# Altium project aboutlove.PrjPCB
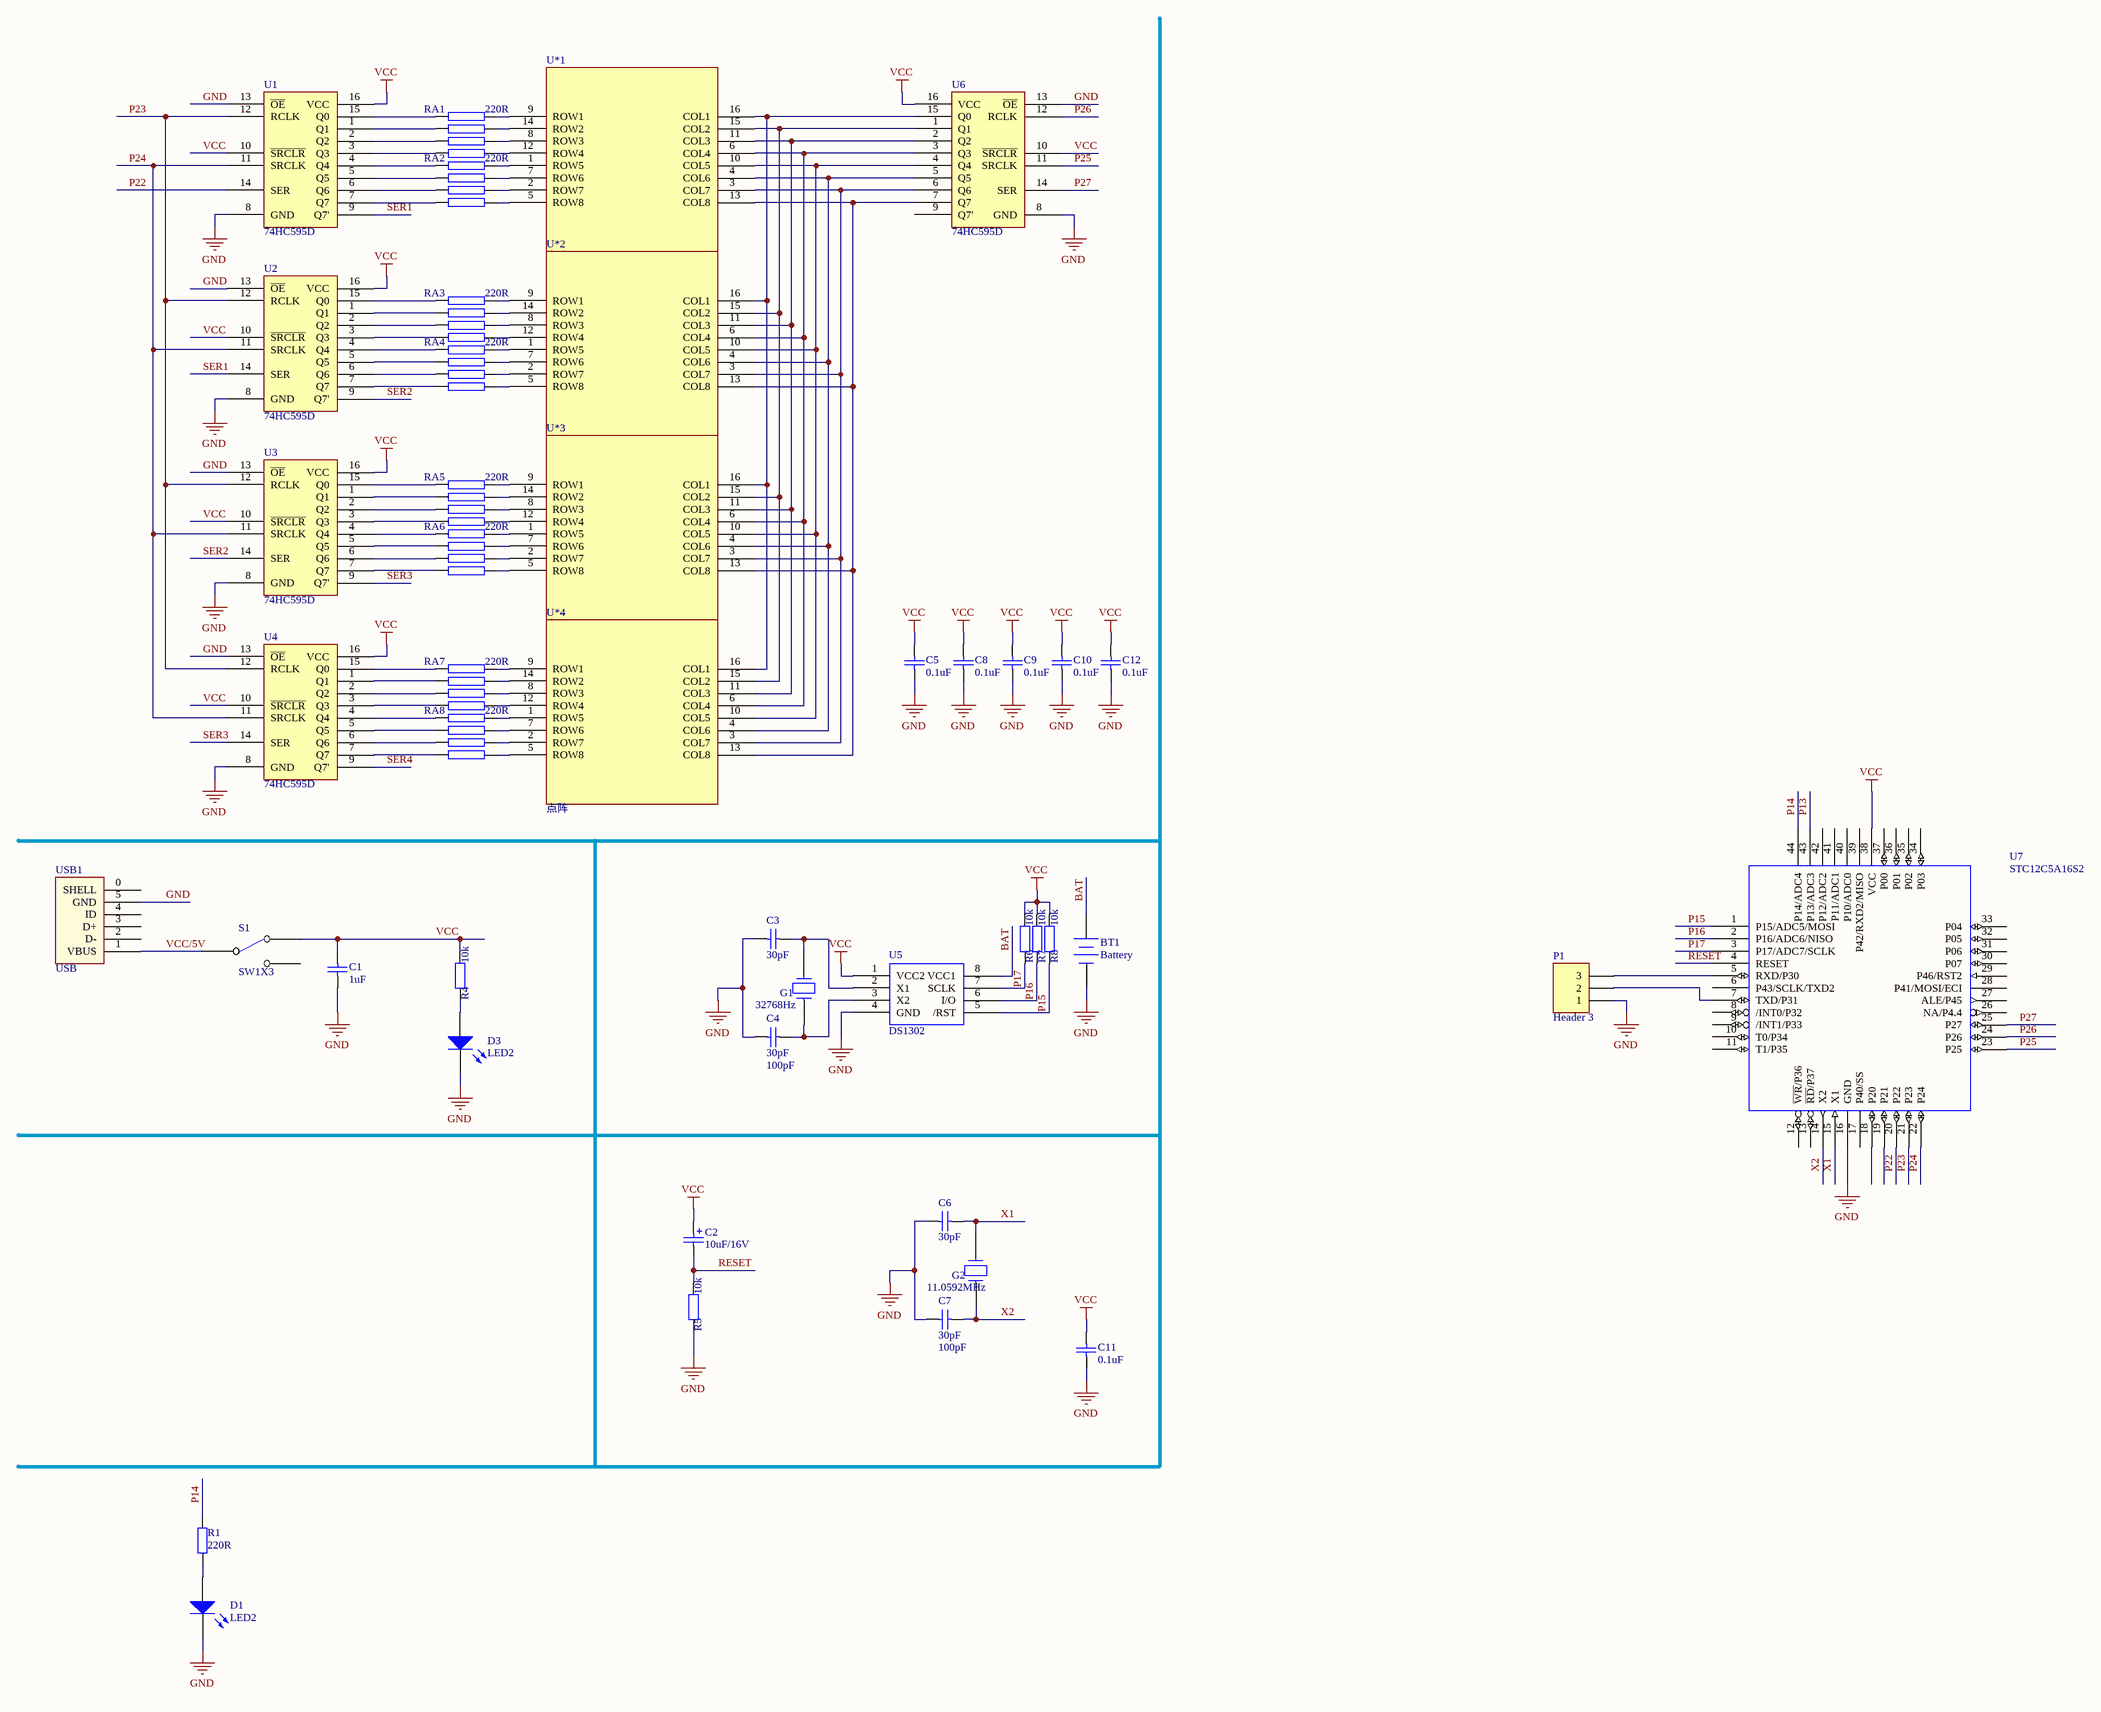
[diagram p0: aboutlove.SchDoc]
1 sheet, 45 parts. Net scope: global (net labels, ports and power ports of the same name join across sheets).
Board file: aboutlove.PcbDoc

## Sheet aboutlove.SchDoc
size A2

### Parts
BT1  Battery  [BAT-CR1220]
C1  1uF  [0805]
C2  10uF/16V  [RB.1/.2A]
C3  30pF  [0603_SMALL]
C4  30pF  value 100pF  [0603_SMALL]
C5  0.1uF  [0603_SMALL]
C6  30pF  [0603_SMALL]
C7  30pF  value 100pF  [0603_SMALL]
C8  0.1uF  [0603_SMALL]
C9  0.1uF  [0603_SMALL]
C10  0.1uF  [0603_SMALL]
C11  0.1uF  [0603_SMALL]
C12  0.1uF  [0603_SMALL]
D1  LED2  [LED0805]
D3  LED2  [LED0805]
G1  32768Hz  [SIP2]
G2  11.0592MHz  [XTAL1_ARC]
P1  Header 3  [HDR1X3]
R1  220R  [0603_SMALL]
R4  10k  [0805]
R5  10k  [0603_SMALL]
R6  10k  [0603_SMALL]
R7  10k  [0603_SMALL]
R8  10k  [0603_SMALL]
RA1  220R  [NR4_L]
RA2  220R  [NR4_L]
RA3  220R  [NR4_L]
RA4  220R  [NR4_L]
RA5  220R  [NR4_L]
RA6  220R  [NR4_L]
RA7  220R  [NR4_L]
RA8  220R  [NR4_L]
S1  SW1X3  [SW1X3]
U1  74HC595D  [SOP16]
U2  74HC595D  [SOP16]
U3  74HC595D  [SOP16]
U4  74HC595D  [SOP16]
U5  DS1302  [SOP8]
U6  74HC595D  [SOP16]
U7  STC12C5A16S2  [TQFP44]
U*1  点阵  [点阵]
U*2  点阵  [点阵]
U*3  点阵  [点阵]
U*4  点阵  [点阵]
USB1  USB  [USB-MINI]

### Nets
GND: BT1.2(-) C1.1 C3.1 C4.1 C5.1 C6.1 C7.1 C8.1 C9.1 C10.1 C11.1 C12.1 D1.2(K) D3.2(K) P1.1 R5.1 U1.8(GND) U1.13(~{OE}) U2.8(GND) U2.13(~{OE}) U3.8(GND) U3.13(~{OE}) U4.8(GND) U4.13(~{OE}) U5.4(GND) U6.8(GND) U6.13(~{OE}) U7.16(GND) USB1.5(GND)
VCC: C1.2 C2.1 C5.2 C8.2 C9.2 C10.2 C11.2 C12.2 R4.2 R6.2 R7.2 R8.2 S1.1 U1.10(~{SRCLR}) U1.16(VCC) U2.10(~{SRCLR}) U2.16(VCC) U3.10(~{SRCLR}) U3.16(VCC) U4.10(~{SRCLR}) U4.16(VCC) U5.1(VCC2) U6.10(~{SRCLR}) U6.16(VCC) U7.38(VCC)
BAT: BT1.1(+) U5.8(VCC1)
P13: U7.43(P13/ADC3)
P14: R1.1 U7.44(P14/ADC4)
P15: R8.1 U5.5(/RST) U7.1(P15/ADC5/MOSI)
P16: R7.1 U5.6(I/O) U7.2(P16/ADC6/NISO)
P17: R6.1 U5.7(SCLK) U7.3(P17/ADC7/SCLK)
P22: U1.14(SER) U7.20(P22)
P23: U1.12(RCLK) U2.12(RCLK) U3.12(RCLK) U4.12(RCLK) U7.21(P23)
P24: U1.11(SRCLK) U2.11(SRCLK) U3.11(SRCLK) U4.11(SRCLK) U7.22(P24)
P25: U6.11(SRCLK) U7.23(P25)
P26: U6.12(RCLK) U7.24(P26)
P27: U6.14(SER) U7.25(P27)
RESET: C2.2 R5.2 U7.4(RESET)
SER1: U1.9(Q7') U2.14(SER)
SER2: U2.9(Q7') U3.14(SER)
SER3: U3.9(Q7') U4.14(SER)
SER4: U4.9(Q7')
VCC/5V: S1.2 USB1.1(VBUS)
X1: C6.2 G2.2 U7.15(X1)
X2: C7.2 G2.1 U7.14(X2)
NetC3_2: C3.2 G1.2 U5.2(X1)
NetC4_2: C4.2 G1.1 U5.3(X2)
NetD1_1: D1.1(A) R1.2
NetD3_1: D3.1(A) R4.1
NetP1_2: P1.2 U7.7(TXD/P31)
NetP1_3: P1.3 U7.5(RXD/P30)
NetRA1_1: RA1.1 U*1.12(ROW4)
NetRA1_2: RA1.2 U*1.8(ROW3)
NetRA1_3: RA1.3 U*1.14(ROW2)
NetRA1_4: RA1.4 U*1.9(ROW1)
NetRA1_5: RA1.5 U1.15(Q0)
NetRA1_6: RA1.6 U1.1(Q1)
NetRA1_7: RA1.7 U1.2(Q2)
NetRA1_8: RA1.8 U1.3(Q3)
NetRA2_1: RA2.1 U*1.5(ROW8)
NetRA2_2: RA2.2 U*1.2(ROW7)
NetRA2_3: RA2.3 U*1.7(ROW6)
NetRA2_4: RA2.4 U*1.1(ROW5)
NetRA2_5: RA2.5 U1.4(Q4)
NetRA2_6: RA2.6 U1.5(Q5)
NetRA2_7: RA2.7 U1.6(Q6)
NetRA2_8: RA2.8 U1.7(Q7)
NetRA3_1: RA3.1 U*2.12(ROW4)
NetRA3_2: RA3.2 U*2.8(ROW3)
NetRA3_3: RA3.3 U*2.14(ROW2)
NetRA3_4: RA3.4 U*2.9(ROW1)
NetRA3_5: RA3.5 U2.15(Q0)
NetRA3_6: RA3.6 U2.1(Q1)
NetRA3_7: RA3.7 U2.2(Q2)
NetRA3_8: RA3.8 U2.3(Q3)
NetRA4_1: RA4.1 U*2.5(ROW8)
NetRA4_2: RA4.2 U*2.2(ROW7)
NetRA4_3: RA4.3 U*2.7(ROW6)
NetRA4_4: RA4.4 U*2.1(ROW5)
NetRA4_5: RA4.5 U2.4(Q4)
NetRA4_6: RA4.6 U2.5(Q5)
NetRA4_7: RA4.7 U2.6(Q6)
NetRA4_8: RA4.8 U2.7(Q7)
NetRA5_1: RA5.1 U*3.12(ROW4)
NetRA5_2: RA5.2 U*3.8(ROW3)
NetRA5_3: RA5.3 U*3.14(ROW2)
NetRA5_4: RA5.4 U*3.9(ROW1)
NetRA5_5: RA5.5 U3.15(Q0)
NetRA5_6: RA5.6 U3.1(Q1)
NetRA5_7: RA5.7 U3.2(Q2)
NetRA5_8: RA5.8 U3.3(Q3)
NetRA6_1: RA6.1 U*3.5(ROW8)
NetRA6_2: RA6.2 U*3.2(ROW7)
NetRA6_3: RA6.3 U*3.7(ROW6)
NetRA6_4: RA6.4 U*3.1(ROW5)
NetRA6_5: RA6.5 U3.4(Q4)
NetRA6_6: RA6.6 U3.5(Q5)
NetRA6_7: RA6.7 U3.6(Q6)
NetRA6_8: RA6.8 U3.7(Q7)
NetRA7_1: RA7.1 U*4.12(ROW4)
NetRA7_2: RA7.2 U*4.8(ROW3)
NetRA7_3: RA7.3 U*4.14(ROW2)
NetRA7_4: RA7.4 U*4.9(ROW1)
NetRA7_5: RA7.5 U4.15(Q0)
NetRA7_6: RA7.6 U4.1(Q1)
NetRA7_7: RA7.7 U4.2(Q2)
NetRA7_8: RA7.8 U4.3(Q3)
NetRA8_1: RA8.1 U*4.5(ROW8)
NetRA8_2: RA8.2 U*4.2(ROW7)
NetRA8_3: RA8.3 U*4.7(ROW6)
NetRA8_4: RA8.4 U*4.1(ROW5)
NetRA8_5: RA8.5 U4.4(Q4)
NetRA8_6: RA8.6 U4.5(Q5)
NetRA8_7: RA8.7 U4.6(Q6)
NetRA8_8: RA8.8 U4.7(Q7)
NetU6_1: U6.1(Q1) U*1.15(COL2) U*2.15(COL2) U*3.15(COL2) U*4.15(COL2)
NetU6_2: U6.2(Q2) U*1.11(COL3) U*2.11(COL3) U*3.11(COL3) U*4.11(COL3)
NetU6_3: U6.3(Q3) U*1.6(COL4) U*2.6(COL4) U*3.6(COL4) U*4.6(COL4)
NetU6_4: U6.4(Q4) U*1.10(COL5) U*2.10(COL5) U*3.10(COL5) U*4.10(COL5)
NetU6_5: U6.5(Q5) U*1.4(COL6) U*2.4(COL6) U*3.4(COL6) U*4.4(COL6)
NetU6_6: U6.6(Q6) U*1.3(COL7) U*2.3(COL7) U*3.3(COL7) U*4.3(COL7)
NetU6_7: U6.7(Q7) U*1.13(COL8) U*2.13(COL8) U*3.13(COL8) U*4.13(COL8)
NetU6_15: U6.15(Q0) U*1.16(COL1) U*2.16(COL1) U*3.16(COL1) U*4.16(COL1)

Not connected (* = marked no-connect by the designer): S1 3; U6 9(Q7'); U7 6(P43/SCLK/TXD2) 8(/INT0/P32) 9(/INT1/P33) 10(T0/P34) 11(T1/P35) 12(~{WR}/P36) 13(~{RD}/P37) 17(P40/SS) 18(P20) 19(P21) 26(NA/P4.4) 27(ALE/P45) 28(P41/MOSI/ECI) 29(P46/RST2) 30(P07) 31(P06) 32(P05) 33(P04) 34(P03) 35(P02) 36(P01) 37(P00) 39(P42/RXD2/MISO) 40(P10/ADC0) 41(P11/ADC1) 42(P12/ADC2); USB1 0(SHELL) 2(D-) 3(D+) 4(ID)

### Library data of the parts
BT1 = Battery: Multicell Battery; Published: 24-Mar-1999; LatestRevisionDate: 17-Jul-2002; LatestRevisionNote: Re-released for DXP Platform.; PackageReference: BAT-2; Publisher: Altium Limited; PackageDescription: Battery; 2 Leads
C1 C3 C5 C6 C8-C12 = Cap: Capacitor; Value: 100pF; Published: 8-Jun-2000; LatestRevisionDate: 17-Jul-2002; LatestRevisionNote: Re-released for DXP Platform.; PackageReference: RAD-0.3; Publisher: Altium Limited; PackageDescription: Radial Cap, Thru-Hole; 2 Leads; 0.3 in Pin Spacing
C2 = Cap Pol2: Polarized Capacitor (Axial); Value: 100pF; Published: 8-Jun-2000; LatestRevisionDate: 17-Jul-2002; LatestRevisionNote: Re-released for DXP Platform.; PackageReference: POLAR0.8; Publisher: Altium Limited; PackageDescription: Polarized Capacitor; 2 Leads
C4 C7 = Cap: Capacitor; Published: 8-Jun-2000; LatestRevisionDate: 17-Jul-2002; LatestRevisionNote: Re-released for DXP Platform.; PackageReference: RAD-0.3; Publisher: Altium Limited; PackageDescription: Radial Cap, Thru-Hole; 2 Leads; 0.3 in Pin Spacing
D1 D3 = LED2: Typical RED, GREEN, YELLOW, AMBER GaAs LED; Published: 8-Jun-2000; LatestRevisionDate: 17-Jul-2002; LatestRevisionNote: Re-released for DXP Platform.; PackageVersion: Feb-2002; PackageReference: 3.2X1.6X1.1; Publisher: Altium Limited; PackageDescription: SM LED; 2 Flat Leads
G1 G2 = CRYSTAL
P1 = Header 3: Header, 3-Pin; LatestRevisionDate: 17-Jul-2002; LatestRevisionNote: Re-released for DXP Platform.; Publisher: Altium Limited
R1 R4-R8 = Res2: Resistor; Value: 1K; Published: 8-Jun-2000; LatestRevisionDate: 17-Jul-2002; LatestRevisionNote: Re-released for DXP Platform.; PackageReference: AXIAL-0.4; Publisher: Altium Limited; PackageDescription: Axial Device, Thru-Hole; 2 Leads; 0.4 in Pin Spacing
RA1-RA8 = NR4
U7 = STC12C5A08S2
U*1-U*4 = 点阵屏